# EasyEDA Pro project ProPrj_AIoT-NTU-Prototype_2026-03-28.epro, schematic Main Board

## Sheets
1 P1: Board Name: Main Board; Create Date: 2026-03-23; Page Name: P1; Project Name: AIoT-NTU-Prototype; Schematic Name: Main Board; Update Date: 2026-03-24; Company: EasyEDA.com; Page Size: A4; Version: V1.0
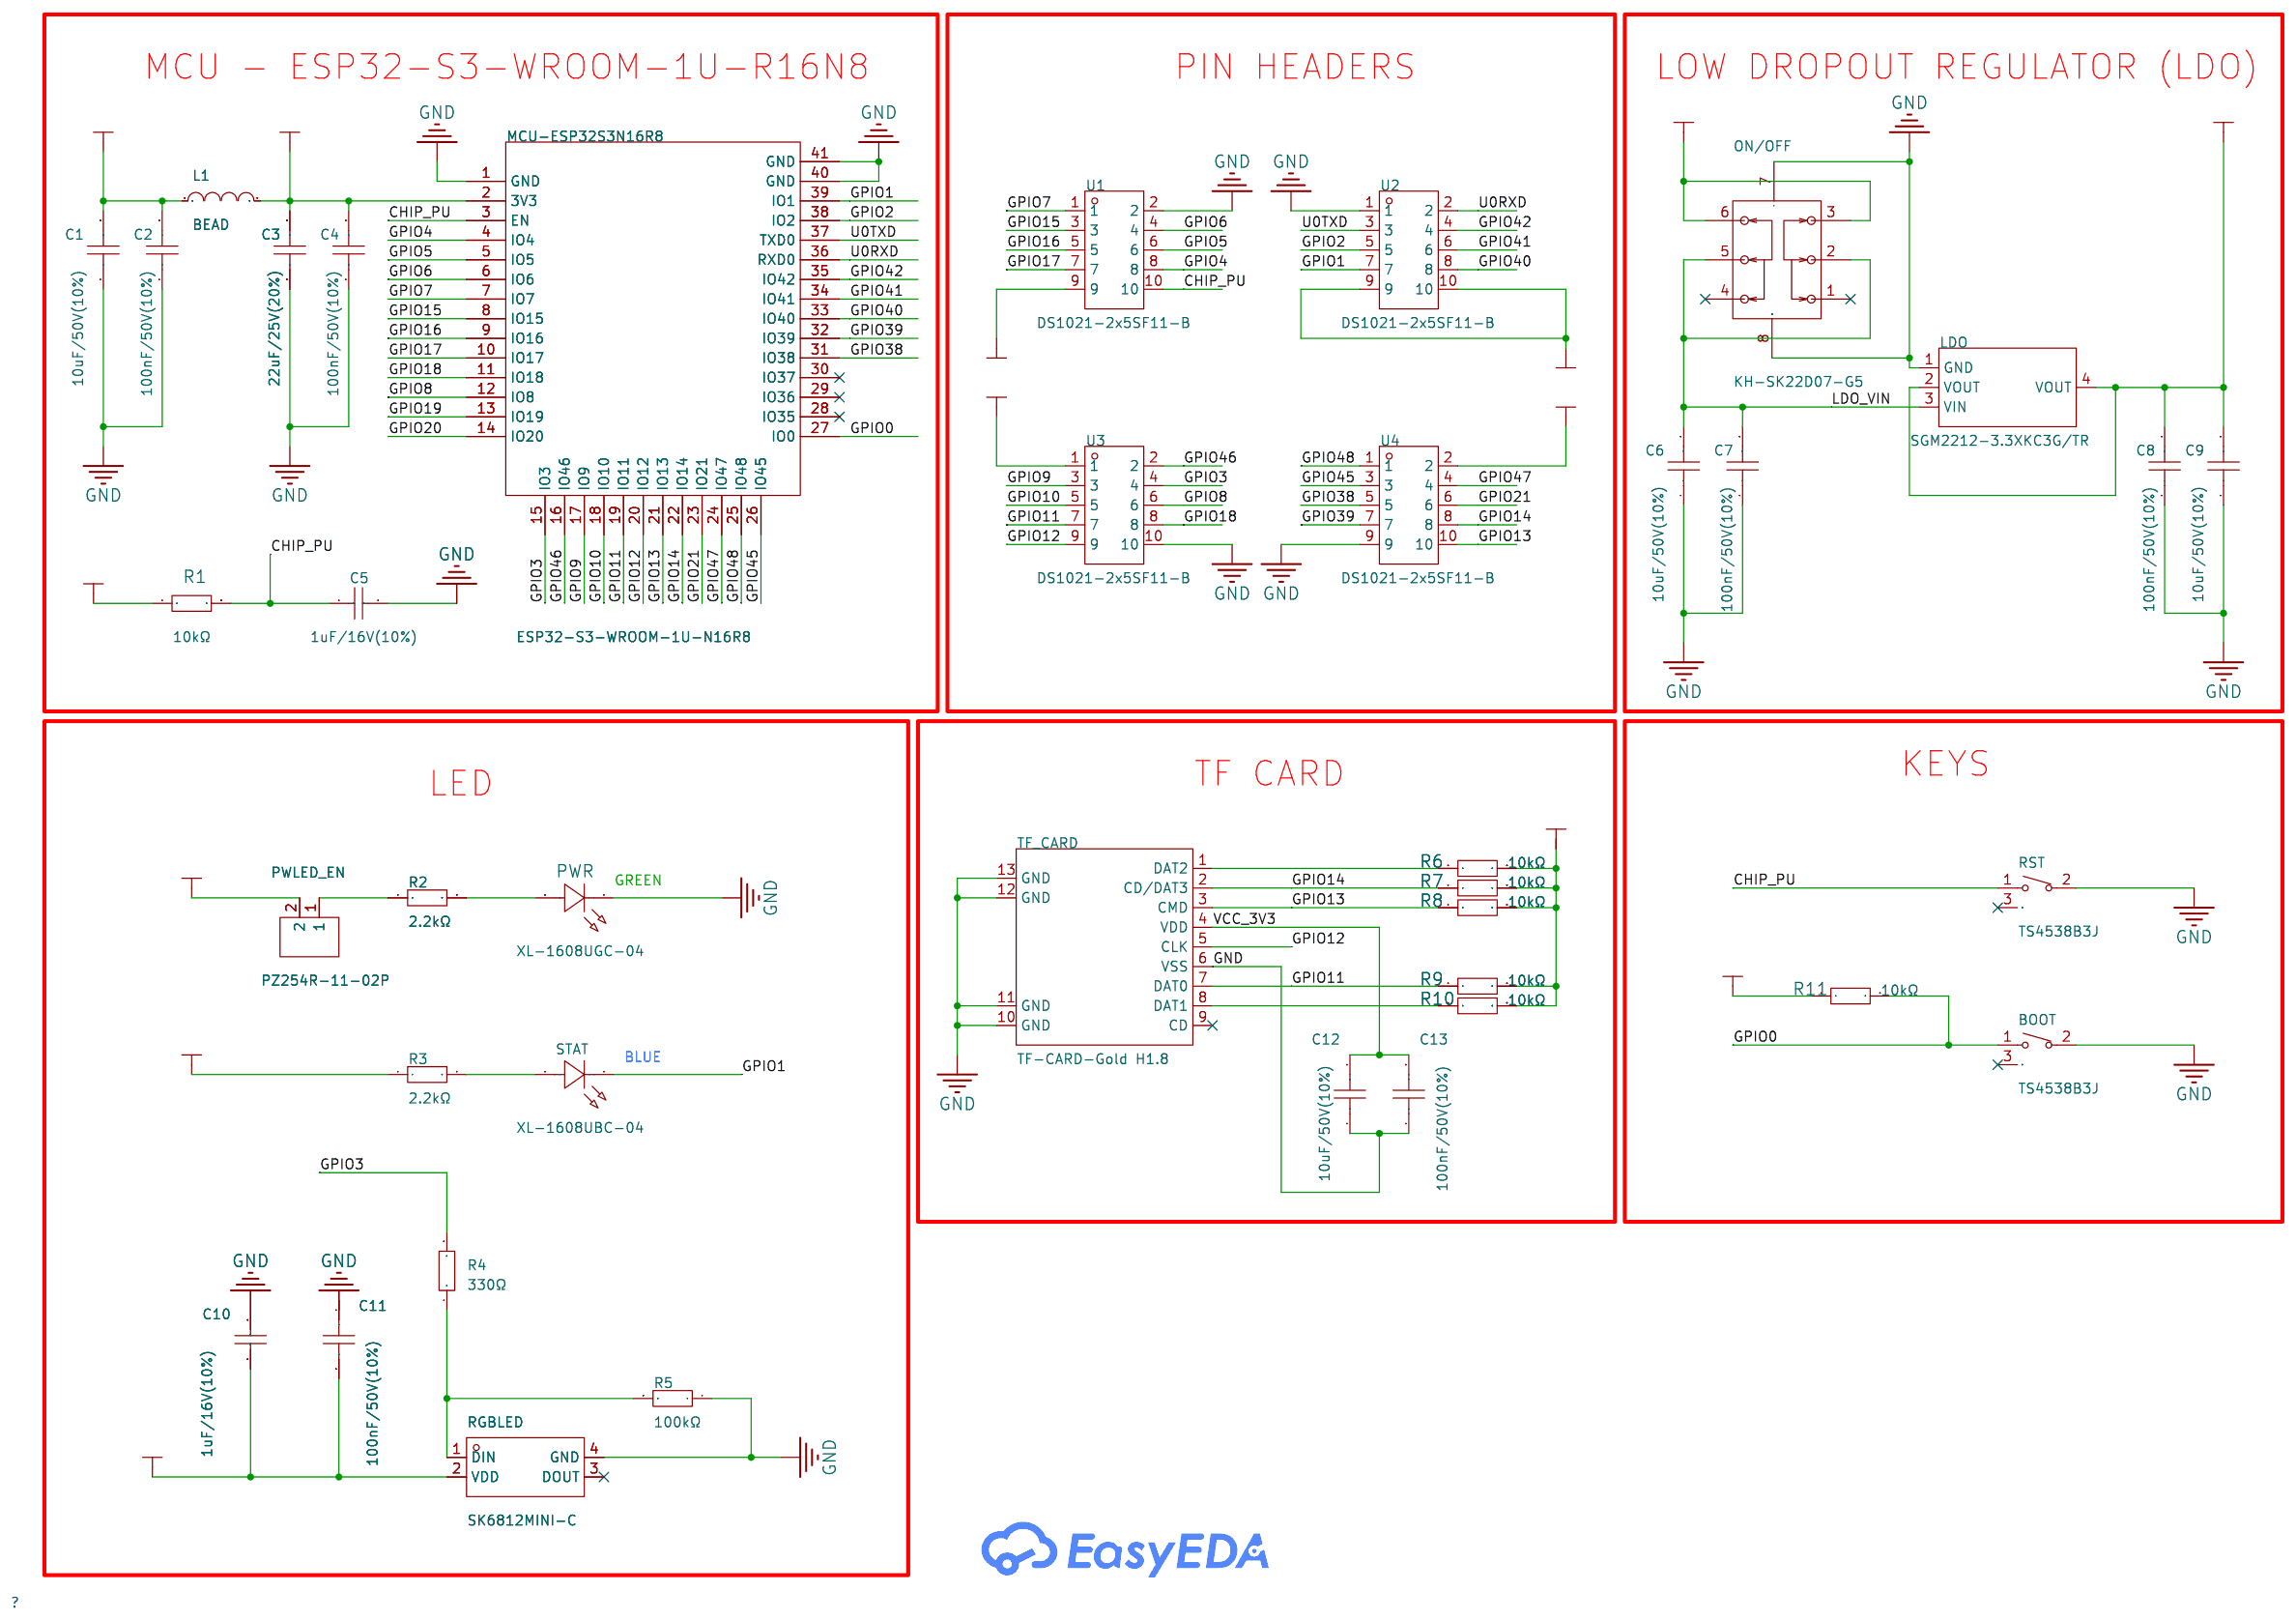
[diagram p1: P1]
2 P2: Page Name: P2; Update Date: 2026-03-27
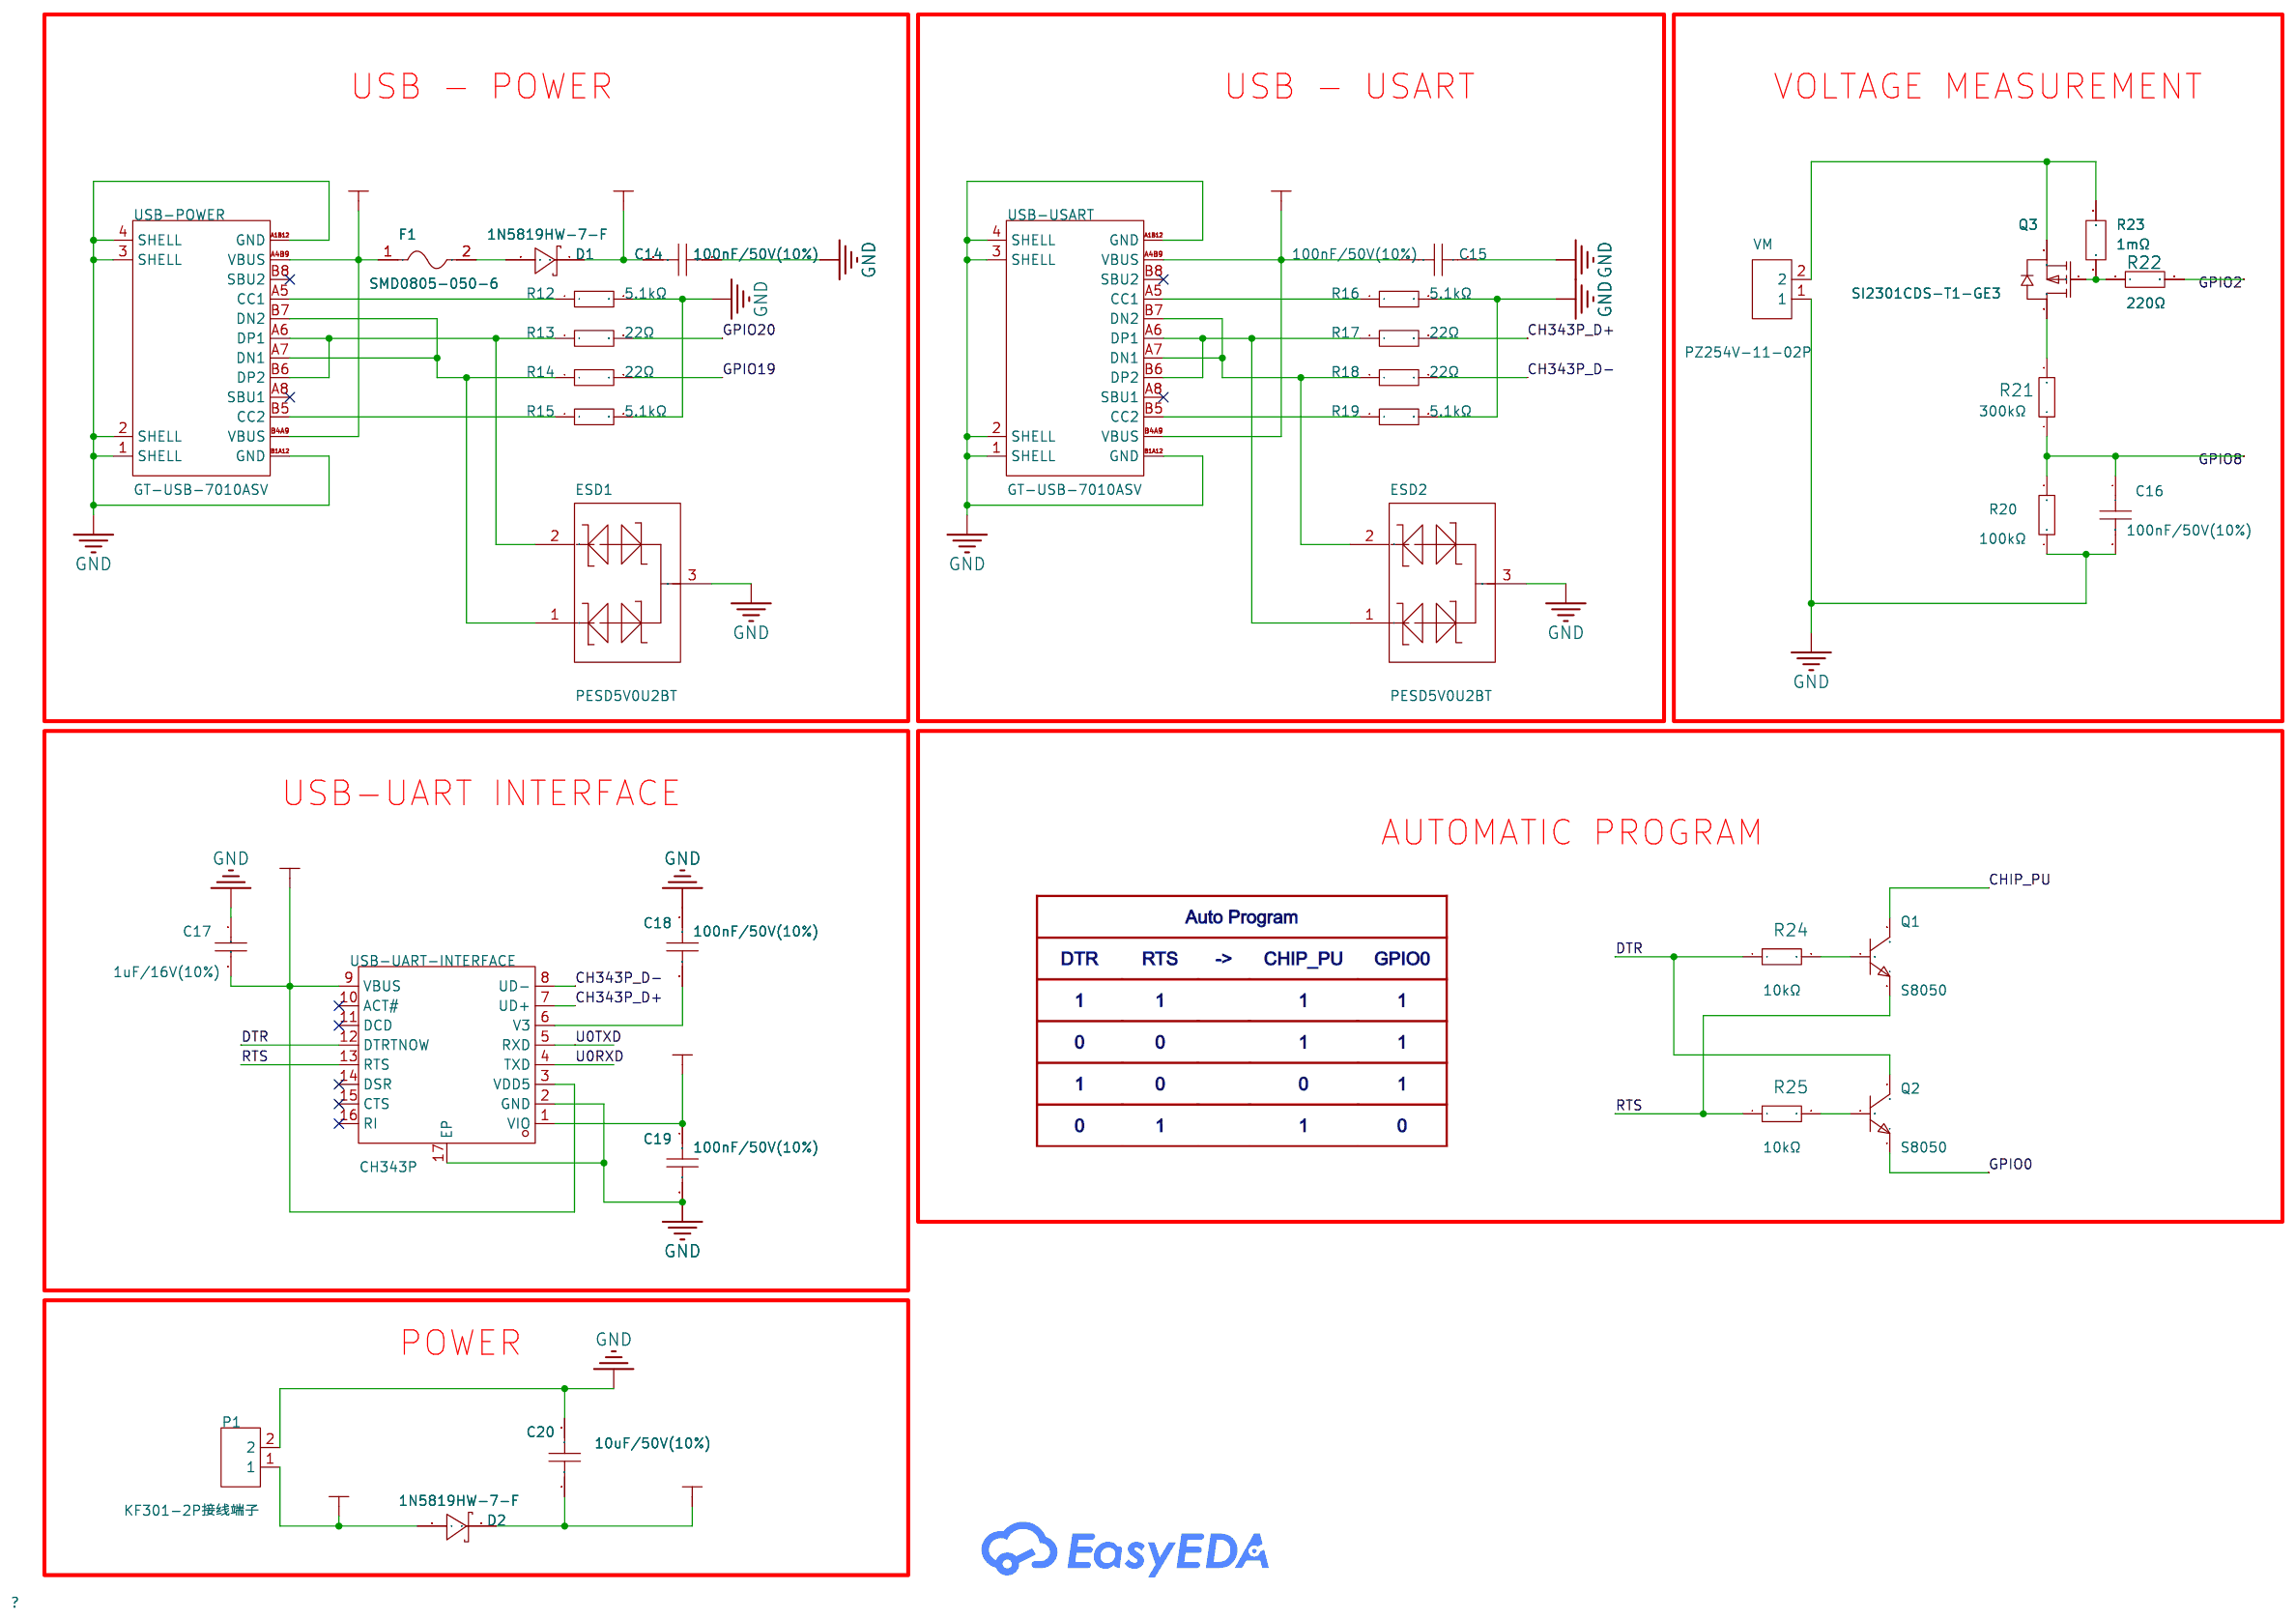
[diagram p2: P2]

## Parts
sheet P1
BOOT  TS4538B3J  [SW-TH_TS4538B3J]
C1  10uF/50V(10%)  [C0805]
C2  100nF/50V(10%)  [C0603]
C3  22uF/25V(20%)  [C0805]
C4  100nF/50V(10%)  [C0603]
C5  1uF/16V(10%)  [C0603]
C6  10uF/50V(10%)  [C0805]
C7  100nF/50V(10%)  [C0603]
C8  100nF/50V(10%)  [C0603]
C9  10uF/50V(10%)  [C0805]
C10  1uF/16V(10%)  [C0603]
C11  100nF/50V(10%)  [C0603]
C12  10uF/50V(10%)  [C0805]
C13  100nF/50V(10%)  [C0603]
L1  BEAD  [L0805]
LDO  SGM2212-3.3XKC3G/TR  [SOT-223-3_L6.5-W3.4-P2.30-LS7.0-BR]
MCU-ESP32S3N16R8  ESP32-S3-WROOM-1U-N16R8  [WIRELM-SMD_ESP32-S3-WROOM-1U]
ON/OFF  KH-SK22D07-G5  [SW-TH_KH-SK22D07-G5]
PWLED_EN  PZ254R-11-02P  [HDR-TH_2P-P2.54-H-M-W10.4]
PWR  XL-1608UGC-04  [LED0603-RD_GREEN]
R1  10kΩ  [R0603]
R2  2.2kΩ  [R0603]
R3  2.2kΩ  [R0603]
R4  330Ω  [R0603]
R5  100kΩ  [R0603]
R6  10kΩ  [R0603]
R7  10kΩ  [R0603]
R8  10kΩ  [R0603]
R9  10kΩ  [R0603]
R10  10kΩ  [R0603]
R11  10kΩ  [R0603]
RGBLED  SK6812MINI-C  [LED-SMD_4P-L3.5-W3.5-R-SK6812MINI]
RST  TS4538B3J  [SW-TH_TS4538B3J]
STAT  XL-1608UBC-04  [LED0603-RD_BLUE]
TF_CARD  TF-CARD-Gold H1.8  [TF-SMD_TF-CARD-H1.8]
U1  DS1021-2x5SF11-B  [HDR-TH_10P-P2.54-V-M-R2-C5-S2.54]
U2  DS1021-2x5SF11-B  [HDR-TH_10P-P2.54-V-M-R2-C5-S2.54]
U3  DS1021-2x5SF11-B  [HDR-TH_10P-P2.54-V-M-R2-C5-S2.54]
U4  DS1021-2x5SF11-B  [HDR-TH_10P-P2.54-V-M-R2-C5-S2.54]
sheet P2
C14  100nF/50V(10%)  [C0603]
C15  100nF/50V(10%)  [C0603]
C16  100nF/50V(10%)  [C0603]
C17  1uF/16V(10%)  [C0603]
C18  100nF/50V(10%)  [C0603]
C19  100nF/50V(10%)  [C0603]
C20  10uF/50V(10%)  [C0805]
D1  1N5819HW-7-F  [SOD-123_L2.7-W1.6-LS3.7-RD]
D2  1N5819HW-7-F  [SOD-123_L2.7-W1.6-LS3.7-RD]
ESD1  PESD5V0U2BT  [SOT-23-3_L2.9-W1.3-P1.90-LS2.4-BR]
ESD2  PESD5V0U2BT  [SOT-23-3_L2.9-W1.3-P1.90-LS2.4-BR]
F1  SMD0805-050-6  [F0805]
P1  KF301-2P接线端子  [CONN-TH_XY301V-A-5.0-2P]
Q1  S8050  [SOT-23-3_L2.9-W1.3-P1.90-LS2.4-BR]
Q2  S8050  [SOT-23-3_L2.9-W1.3-P1.90-LS2.4-BR]
Q3  SI2301CDS-T1-GE3  [SOT-23-3_L3.0-W1.7-P0.95-LS2.9-BR]
R12  5.1kΩ  [R0603]
R13  22Ω  [R0603]
R14  22Ω  [R0603]
R15  5.1kΩ  [R0603]
R16  5.1kΩ  [R0603]
R17  22Ω  [R0603]
R18  22Ω  [R0603]
R19  5.1kΩ  [R0603]
R20  100kΩ  [R0603]
R21  300kΩ  [R0603]
R22  220Ω  [R0603]
R23  1mΩ  [R0603]
R24  10kΩ  [R0603]
R25  10kΩ  [R0603]
USB-POWER  GT-USB-7010ASV  [USB-C-SMD_G-SWITCH_GT-USB-7010ASV]
USB-UART-INTERFACE  CH343P  [TQFN-16_L3.0-W3.0-P0.50-BL-EP1.7]
USB-USART  GT-USB-7010ASV  [USB-C-SMD_G-SWITCH_GT-USB-7010ASV]
VM  PZ254V-11-02P  [HDR-TH_2P-P2.54-V-M]

## Library data of the parts
BOOT RST = TS4538B3J: Circuit:SPST Actuator Style:Round Button Operating Force:250gf Mounting Style:Lying Switch Length:4.5mm Switch Width:4.5mm Switch Height:3.8mm Strike Gundam:不带 Contact Current:50mA Voltage Rating (DC):12V Insulation Resistance:100MΩ Actuator/Cap Color:Bla; LCSC Part Name: 4.5*4.5*3.8mm 卧插 轻触开关; Supplier Part: C2681490; Manufacturer: SHOU HAN(首韩); Supplier Footprint: 插件; JLCPCB Part Class: Extended Part; Datasheet: https://atta.szlcsc.com/upload/public/pdf/source/20210107/C2681490_30B9DCB4D025C2EF087670BE9B72D0BC.pdf; Supplier: LCSC; Circuit: SPST; Actuator Style: Round Button; Operating Force: 250gf; Mounting Style: Lying; Switch Length: 4.5mm; Switch Width: 4.5mm; Switch Height: 3.8mm; Strike Gundam: 不带; Contact Current: 50mA; Voltage Rating (DC): 12V; Insulation Resistance: 100MΩ; Actuator/Cap Color: Black; Pin Style: PCPin; Mechanical Life: 10万次; Operating Temperature: -25℃~+70℃
C1 C6 C9 C12 C20 = GRM21BR61H106KE43L: Capacitance:10uF Tolerance:±10% Tolerance:±10% Voltage Rating:50V Temperature Coefficient:X5R; LCSC Part Name: 10uF ±10% 50V; Supplier Part: C440198; Manufacturer: muRata(村田); Supplier Footprint: 0805; JLCPCB Part Class: Basic Part; Datasheet: https://item.szlcsc.com/datasheet/GRM21BR61H106KE43L/439567.html; Supplier: LCSC; Tolerance: ±10%; Voltage Rating: 50V; Temperature Coefficient: X5R
C2 C4 C7 C8 C11 C13-C16 C18 C19 = CC0603KRX7R9BB104: Capacitance:100nF Tolerance:±10% Tolerance:±10% Voltage Rating:50V Temperature Coefficient:X7R; LCSC Part Name: 100nF ±10% 50V; Supplier Part: C14663; Manufacturer: YAGEO(国巨); Supplier Footprint: 0603; JLCPCB Part Class: Basic Part; Datasheet: https://item.szlcsc.com/datasheet/CC0603KRX7R9BB104/15331.html; Supplier: LCSC; Tolerance: ±10%; Voltage Rating: 50V; Temperature Coefficient: X7R
C3 = CL21A226MAQNNNE: Capacitance:22uF Tolerance:±20% Tolerance:±20% Voltage Rating:25V Temperature Coefficient:X5R; LCSC Part Name: 22uF ±20% 25V; Supplier Part: C45783; Manufacturer: SAMSUNG(三星); Supplier Footprint: 0805; JLCPCB Part Class: Basic Part; Datasheet: https://item.szlcsc.com/datasheet/CL21A226MAQNNNE/46786.html; Supplier: LCSC; Tolerance: ±20%; Voltage Rating: 25V; Temperature Coefficient: X5R
C5 C10 C17 = CL10A105KO8NNNC: Capacitance:1uF Tolerance:±10% Tolerance:±10% Voltage Rating:16V Temperature Coefficient:X5R; LCSC Part Name: 1uF ±10% 16V; Supplier Part: C1592; Manufacturer: SAMSUNG(三星); Supplier Footprint: 0603; JLCPCB Part Class: Extended Part; Datasheet: https://item.szlcsc.com/datasheet/CL10A105KO8NNNC/1944.html; Supplier: LCSC; Tolerance: ±10%; Voltage Rating: 16V; Temperature Coefficient: X5R
L1 = 74279220601: Impedance @ Frequency:600Ω@100MHz Tolerance:±25% Tolerance:±25% DC Resistance(DCR):80mΩ Current Rating:2.1A Number of Circuits:1 Operating Temperature:-55℃~+125℃ Operating Temperature:-55℃~+125℃; LCSC Part Name: 单路 0805磁珠 阻抗600Ω@100MHz; Supplier Part: C2661425; Manufacturer: Wurth(伍尔特); Supplier Footprint: 0805; JLCPCB Part Class: Extended Part; Datasheet: https://www.we-online.com/components/products/datasheet/74279220601.pdf; Supplier: LCSC; Impedance @ Frequency: 600Ω@100MHz; Tolerance: ±25%; DC Resistance(DCR): 80mΩ; Current Rating: 2.1A; Number of Circuits: 1; Operating Temperature: -55℃~+125℃
LDO = SGM2212-3.3XKC3G/TR_C3294699: Output Type:Fixed Voltage - Supply:20V Output Voltage:3.3V Output Voltage:3.3V Output Current:800mA Power Supply Rejection Ratio (PSRR):80dB@(120Hz) Voltage Dropout:450mV@(800mA) standby current:80uA Noise:0.002%Vout Features:Short Circuit Protection；Ther; LCSC Part Name: 800mA、低噪声、低静态电流、高电源抑制比、低压差线性稳压器; Supplier Part: C3294699; Manufacturer: SGMICRO(圣邦微); Supplier Footprint: SOT-223-3; JLCPCB Part Class: Extended Part; Datasheet: https://item.szlcsc.com/datasheet/SGM2212-3.3XKC3G%252FTR/3859121.html; Supplier: LCSC; Output Type: Fixed; Voltage - Supply: 20V; Output Voltage: 3.3V; Output Current: 800mA; Power Supply Rejection Ratio (PSRR): 80dB@(120Hz); Voltage Dropout: 450mV@(800mA); standby current: 80uA; Noise: 0.002%Vout; Features: Short Circuit Protection；Thermal Shutdown; Operating Temperature: -40℃~+125℃
MCU-ESP32S3N16R8 = ESP32-S3-WROOM-1U-N16R8: Supplier Part: C3013946; Manufacturer: ESPRESSIF(乐鑫); Supplier Footprint: SMD,19.2x18mm; JLCPCB Part Class: Extended Part; Datasheet: https://item.szlcsc.com/datasheet/ESP32-S3-WROOM-1U-N16R8/3522416.html; Supplier: LCSC
ON/OFF = KH-SK22D07-G5: LCSC Part Name: 拨动开关 KH-SK22D07-G5 胶底(SK22D02); Supplier Part: C5274511; Manufacturer: kinghelm(金航标); Supplier Footprint: 插件; JLCPCB Part Class: Extended Part; Datasheet: https://atta.szlcsc.com/upload/public/pdf/source/20221118/893B1B9D65297A6DA5150F3A9CB4E986.pdf; Supplier: LCSC
PWLED_EN = PZ254R-11-02P: Pin Structure:1x2P Pitch:2.54mm Row Spacing:- Circluar Pins/Square Pins:Pin Header Mounting Type:Right Angle Number of Rows:1 Number of Pins:2P Current Rating:- Voltage Rating (Max):- Length of Mating Pin:6mm Insulation Height:2.5mm Contact Material:Brass; LCSC Part Name: 1x2P 间距:2.54mm 方针 弯插; Supplier Part: C492410; Manufacturer: XFCN(兴飞); Supplier Footprint: 弯插,P=2.54mm; JLCPCB Part Class: Extended Part; Datasheet: https://item.szlcsc.com/datasheet/PZ254R-11-02P/502966.html; Supplier: LCSC; Pin Structure: 1x2P; Pitch: 2.54mm; Circluar Pins/Square Pins: Pin Header; Mounting Type: Right Angle; Number of Rows: 1; Number of Pins: 2P; Length of Mating Pin: 6mm; Insulation Height: 2.5mm; Contact Material: Brass; Operating Temperature: -40℃~+105℃; Color: Black
PWR = XL-1608UGC-04: Lamp Holder Type:- Illumination Color:Emerald Green Voltage - Forward(Vf):3.3V Voltage - Forward(Vf):3.3V Power(Watts):70mW Forward Current:20mA Wavelength - Dominant:515nm~535nm Wavelength - Dominant:515nm~535nm Peak Wavelength:525nm Diode Configuration:; LCSC Part Name: 0603翠绿贴片式发光二极管; Supplier Part: C965804; Manufacturer: XINGLIGHT(成兴光); Supplier Footprint: 0603; JLCPCB Part Class: Extended Part; Datasheet: https://item.szlcsc.com/datasheet/XL-1608UGC-04/1051413.html; Supplier: LCSC; Illumination Color: Emerald Green; Voltage - Forward(Vf): 3.3V; Power(Watts): 70mW; Forward Current: 20mA; Wavelength - Dominant: 515nm~535nm; Peak Wavelength: 525nm; Diode Configuration: Discrete Diode; Lens Color: Water Clear; Luminous Intensity: 810mcd; Viewing Angle: 120°; Mounting Style: Top-mount; Operating Temperature: -40℃~+85℃
R1 R6-R11 R24 R25 = 0603WAF1002T5E: Type:Thick Film Resistor Resistance:10kΩ Tolerance:±1% Tolerance:±1% Power(Watts):100mW Voltage-Supply(Max):75V Temperature Coefficient:±100ppm/℃ Temperature Coefficient:±100ppm/℃ Operating Temperature:-55℃~+155℃ Operating Temperature:-55℃~+155℃; LCSC Part Name: 厚膜电阻 10kΩ ±1% 100mW; Supplier Part: C25804; Manufacturer: UNI-ROYAL(厚声); Supplier Footprint: 0603; JLCPCB Part Class: Basic Part; Datasheet: https://item.szlcsc.com/datasheet/0603WAF1002T5E/26547.html; Supplier: LCSC; Type: Thick Film Resistor; Tolerance: ±1%; Power(Watts): 100mW; Voltage-Supply(Max): 75V; Temperature Coefficient: ±100ppm/℃; Operating Temperature: -55℃~+155℃
R2 R3 = 0603WAF2201T5E_C4190: Type:Thick Film Resistors Resistance:2.2kΩ Tolerance:±1% Tolerance:±1% Power(Watts): Overload Voltage (Max): Temperature Coefficient:±100ppm/℃ Temperature Coefficient:±100ppm/℃ Operating Temperature Range:-55℃~+155℃ Operating Temperature Range:-55℃~+155℃; LCSC Part Name: 2.2kΩ ±1% 100mW 厚膜电阻; Supplier Part: C4190; Manufacturer: UNI-ROYAL(厚声); Manufacturer Part: 0603WAF2201T5E; Supplier Footprint: 0603; JLCPCB Part Class: Basic Part; Datasheet: https://atta.szlcsc.com/upload/public/pdf/source/20200306/C422600_1E6D84923E4A46A82E41ADD87F860B5C.pdf; Supplier: LCSC; Type: Thick Film Resistors; Tolerance: ±1%; Temperature Coefficient: ±100ppm/℃; Operating Temperature Range: -55℃~+155℃
R4 = 0603WAF3300T5E: Type:Thick Film Resistors Resistance: Tolerance:±1% Tolerance:±1% Power(Watts): Overload Voltage (Max): Temperature Coefficient:±100ppm/℃ Temperature Coefficient:±100ppm/℃ Operating Temperature Range:-55℃~+155℃ Operating Temperature Range:-55℃~+155℃; LCSC Part Name: 330Ω ±1% 100mW 厚膜电阻; Supplier Part: C23138; Manufacturer: UNI-ROYAL(厚声); Supplier Footprint: 0603; JLCPCB Part Class: Basic Part; Datasheet: https://atta.szlcsc.com/upload/public/pdf/source/20200306/C422600_1E6D84923E4A46A82E41ADD87F860B5C.pdf; Supplier: LCSC; Type: Thick Film Resistors; Tolerance: ±1%; Temperature Coefficient: ±100ppm/℃; Operating Temperature Range: -55℃~+155℃
R5 R20 = 0603WAF1003T5E: Type:Thick Film Resistor Resistance:100kΩ Tolerance:±1% Tolerance:±1% Power(Watts):100mW Voltage-Supply(Max):75V Temperature Coefficient:±100ppm/℃ Temperature Coefficient:±100ppm/℃ Operating Temperature:-55℃~+155℃ Operating Temperature:-55℃~+155℃; LCSC Part Name: 100kΩ ±1% 100mW 厚膜电阻; Supplier Part: C25803; Manufacturer: UNI-ROYAL(厚声); Supplier Footprint: 0603; JLCPCB Part Class: Basic Part; Datasheet: https://item.szlcsc.com/datasheet/0603WAF1003T5E/26546.html; Supplier: LCSC; Type: Thick Film Resistor; Tolerance: ±1%; Power(Watts): 100mW; Voltage-Supply(Max): 75V; Temperature Coefficient: ±100ppm/℃; Operating Temperature: -55℃~+155℃
RGBLED = SK6812MINI-C: Wavelength:R:615nm~625nm；B:460nm~470nm；G:520nm~530nm Luminous Intensity:B:160mcd~320mcd；R:280mcd~515mcd；G:815mcd~1275mcd Fixed-Frequency Pwm Mode:1kHz Voltage - Supply:3.7V~5.5V Voltage - Supply:3.7V~5.5V Quiescent Current:0.65mA ESD Withstand Voltage:200; Supplier Part: C7423117; Manufacturer: 欧思科光电; Supplier Footprint: SMD-4P,3.7x3.5mm; JLCPCB Part Class: Extended Part; Datasheet: https://item.szlcsc.com/datasheet/SK6812MINI-C/8407590.html; Supplier: LCSC; Wavelength: R:615nm~625nm；B:460nm~470nm；G:520nm~530nm; Luminous Intensity: B:160mcd~320mcd；R:280mcd~515mcd；G:815mcd~1275mcd; Fixed-Frequency Pwm Mode: 1kHz; Voltage - Supply: 3.7V~5.5V; Quiescent Current: 0.65mA; ESD Withstand Voltage: 2000V; Operating Temperature: -40℃~+85℃; Viewing Angle: 120°; Length: 3.5mm; Width: 1.1mm; Height: 3.7mm
STAT = XL-1608UBC-04: Lamp Holder Type:- Illumination Color:Blue Voltage - Forward(Vf):3.3V Voltage - Forward(Vf):3.3V Power(Watts):70mW Forward Current:20mA Wavelength - Dominant:455nm~475nm Wavelength - Dominant:455nm~475nm Peak Wavelength:470nm Diode Configuration:- Lens Co; LCSC Part Name: 0603蓝色贴片式发光二极管; Supplier Part: C965807; Manufacturer: XINGLIGHT(成兴光); Supplier Footprint: 0603; JLCPCB Part Class: Extended Part; Datasheet: https://item.szlcsc.com/datasheet/XL-1608UBC-04/1051416.html; Supplier: LCSC; Illumination Color: Blue; Voltage - Forward(Vf): 3.3V; Power(Watts): 70mW; Forward Current: 20mA; Wavelength - Dominant: 455nm~475nm; Peak Wavelength: 470nm; Lens Color: Water Clear; Luminous Intensity: 300mcd; Viewing Angle: 120°; Mounting Style: op View Mount
TF_CARD = TF-CARD-Gold H1.8: Card Connection Mode:Push-Push Card Type:MicroSD Card (TF Card) Connector Type:Connector and Ejector Additional Card Detection Pins:- Supplementary Features:- Height Above Board:1.8mm Operating Temperature:-40℃~+70℃ Operating Temperature:-40℃~+70℃; LCSC Part Name: 9P，自弹式TF卡座; Supplier Part: C7529390; Manufacturer: SHOU HAN(首韩); Supplier Footprint: SMD; JLCPCB Part Class: Extended Part; Datasheet: https://item.szlcsc.com/datasheet/TF-CARD-Gold%2520H1.8/8629777.html; Supplier: LCSC; Card Connection Mode: Push-Push; Card Type: MicroSD Card (TF Card); Connector Type: Connector and Ejector; Height Above Board: 1.8mm; Operating Temperature: -40℃~+70℃
U1-U4 = DS1021-2x5SF11-B: Pin Structure:2x5P Pitch:2.54mm Row Spacing:2.54mm Circluar Pins/Square Pins:Pin Header Mounting Type:Through Hole Number of Rows:2 Number of Pins:10P Current Rating:3A Voltage Rating (Max):250V Contact Material:Copper Alloy Contact Plating:Gold Operating; LCSC Part Name: 2x5P 间距:2.54mm 方针 直插; Supplier Part: C7430401; Manufacturer: CONNFLY; Supplier Footprint: 插件,P=2.54mm; Datasheet: https://item.szlcsc.com/datasheet/DS1021-2x5SF11-B/8430054.html; Supplier: LCSC; Pin Structure: 2x5P; Pitch: 2.54mm; Row Spacing: 2.54mm; Circluar Pins/Square Pins: Pin Header; Mounting Type: Through Hole; Number of Rows: 2; Number of Pins: 10P; Current Rating: 3A; Voltage Rating (Max): 250V; Contact Material: Copper Alloy; Contact Plating: Gold; Operating Temperature: -40℃~+105℃; Color: Black
D1 D2 = 1N5819HW-7-F: Diode Configuration:1 Independent Voltage - Forward(Vf@If):450mV@1A Voltage - DC Reverse(Vr):40V Current - Rectified:1A Reverse Leakage Current (Ir):1mA@40V Operating Junction Temperature Range:-65℃~+150℃ Operating Junction Temperature Range:-65℃~+150℃ No; LCSC Part Name: 电压:40V 电流:1A; Supplier Part: C82544; Manufacturer: DIODES(美台); Supplier Footprint: SOD-123; JLCPCB Part Class: Extended Part; Datasheet: https://item.szlcsc.com/datasheet/1N5819HW-7-F/83701.html; Supplier: LCSC; Diode Configuration: 1 Independent; Voltage - Forward(Vf@If): 450mV@1A; Voltage - DC Reverse(Vr): 40V; Current - Rectified: 1A; Reverse Leakage Current (Ir): 1mA@40V; Operating Junction Temperature Range: -65℃~+150℃; Non-Repetitive Peak Forward Surge Current: 25A
ESD1 ESD2 = PESD5V0U2BT: Polarity:Bidirectional Reverse Stand-Off Voltage (Vrwm):5V Voltage - Breakdown:9V Reverse Leakage Current (Ir):60nA Number of Channels:2 level of protection:IEC 61000-4-5 Type:ESD Junction Capacitance:2.5pF; LCSC Part Name: ESD 5V截止; Supplier Part: C2905622; Manufacturer: TECH PUBLIC(台舟); Supplier Footprint: SOT-23; JLCPCB Part Class: Extended Part; Datasheet: https://item.szlcsc.com/datasheet/PESD5V0U2BT/3175919.html; Supplier: LCSC; Polarity: Bidirectional; Reverse Stand-Off Voltage (Vrwm): 5V; Voltage - Breakdown: 9V; Reverse Leakage Current (Ir): 60nA; Number of Channels: 2; level of protection: IEC 61000-4-5; Type: ESD; Junction Capacitance: 2.5pF
F1 = SMD0805-050-6: Voltage - Max:6V Current - Max:40A Hold Current:500mA Trip Current:1A Power Dissipation:500mW Resistance - Initial (Ri) (Min):100mΩ Resistance - Post Trip (R1) (Max):850mΩ Time to Trip(Max):100ms Operating Temperature:-40℃~+85℃ Operating Temperature:-40℃~; LCSC Part Name: 6V 500mA; Supplier Part: C46640983; Manufacturer: R+O(宏嘉诚); Supplier Footprint: 0805; JLCPCB Part Class: Extended Part; Datasheet: https://item.szlcsc.com/datasheet/SMD0805-050-6/48798689.html; Supplier: LCSC; Voltage - Max: 6V; Current - Max: 40A; Hold Current: 500mA; Trip Current: 1A; Power Dissipation: 500mW; Resistance - Initial (Ri) (Min): 100mΩ; Resistance - Post Trip (R1) (Max): 850mΩ; Time to Trip(Max): 100ms; Operating Temperature: -40℃~+85℃; Length: 2.2mm; Width: 1.5mm; Height: 0.8mm
P1 = KF301-2P接线端子: Supplier Part: C9900016950; Supplier Footprint: CK301-2P; JLCPCB Part Class: Extended Part; Supplier: LCSC
Q1 Q2 = S8050_C2688231: type:NPN Current - Collector(Ic):800mA Collector - Emitter Voltage VCEO:25V Pd - Power Dissipation:350mW DC Current Gain:200@50mA,1V DC Current Gain:200@50mA,1V Transition frequency(fT):150MHz Current - Collector Cutoff:100nA Vce Saturation(VCE(sat)):600m; LCSC Part Name: NPN 电流:0.8A 电压:25V; Supplier Part: C2688231; Manufacturer: WPMtek(维攀); Supplier Footprint: SOT-23; JLCPCB Part Class: Extended Part; Datasheet: https://item.szlcsc.com/datasheet/S8050/2793369.html; Supplier: LCSC; type: NPN; Current - Collector(Ic): 800mA; Collector - Emitter Voltage VCEO: 25V; Pd - Power Dissipation: 350mW; DC Current Gain: 200@50mA,1V; Transition frequency(fT): 150MHz; Current - Collector Cutoff: 100nA; Vce Saturation(VCE(sat)): 600mV@500mA,50mA; Emitter-Base Voltage(Vebo): 5V
Q3 = SI2301CDS-T1-GE3: Number:1 P-Channel Drain to Source Voltage:20V Current - Continuous Drain(Id):3.1A RDS(on):142mΩ@2.5V,2.7A Pd - Power Dissipation:1.6W Gate Threshold Voltage (Vgs(th)):1V@250uA Gate Charge(Qg):10nC@4.5V Input Capacitance(Ciss):405pF Reverse Transfer Capac; LCSC Part Name: 1个P沟道 耐压:20V 电流:3.1A; Supplier Part: C10487; Manufacturer: VISHAY(威世); Supplier Footprint: SOT-23; Datasheet: https://item.szlcsc.com/datasheet/SI2301CDS-T1-GE3/11030.html; Supplier: LCSC; Number: 1 P-Channel; Drain to Source Voltage: 20V; Current - Continuous Drain(Id): 3.1A; RDS(on): 142mΩ@2.5V,2.7A; Pd - Power Dissipation: 1.6W; Gate Threshold Voltage (Vgs(th)): 1V@250uA; Gate Charge(Qg): 10nC@4.5V; Input Capacitance(Ciss): 405pF; Reverse Transfer Capacitance (Crss@Vds): 55pF; Operating Temperature: -55℃~+150℃; Type: P-Channel; Output Capacitance(Coss): 75pF
R12 R15 R16 R19 = 0603WAF5101T5E: Type:Thick Film Resistor Resistance:5.1kΩ Tolerance:±1% Tolerance:±1% Power(Watts):100mW Voltage-Supply(Max):75V Temperature Coefficient:±100ppm/℃ Temperature Coefficient:±100ppm/℃ Operating Temperature:-55℃~+155℃ Operating Temperature:-55℃~+155℃; LCSC Part Name: 5.1kΩ ±1% 100mW 厚膜电阻; Supplier Part: C23186; Manufacturer: UNI-ROYAL(厚声); Supplier Footprint: 0603; JLCPCB Part Class: Basic Part; Datasheet: https://item.szlcsc.com/datasheet/0603WAF5101T5E/23913.html; Supplier: LCSC; Type: Thick Film Resistor; Tolerance: ±1%; Power(Watts): 100mW; Voltage-Supply(Max): 75V; Temperature Coefficient: ±100ppm/℃; Operating Temperature: -55℃~+155℃
R13 R14 R17 R18 = 0603WAF220JT5E: Type:Thick Film Resistors Resistance:22Ω Tolerance:±1% Tolerance:±1% Power(Watts): Overload Voltage (Max): Temperature Coefficient:±100ppm/℃ Temperature Coefficient:±100ppm/℃ Operating Temperature Range:-55℃~+155℃ Operating Temperature Range:-55℃~+155℃; LCSC Part Name: 22Ω ±1% 100mW 厚膜电阻; Supplier Part: C23345; Manufacturer: UNI-ROYAL(厚声); Supplier Footprint: 0603; JLCPCB Part Class: Basic Part; Datasheet: https://atta.szlcsc.com/upload/public/pdf/source/20200306/C422600_1E6D84923E4A46A82E41ADD87F860B5C.pdf; Supplier: LCSC; Type: Thick Film Resistors; Tolerance: ±1%; Temperature Coefficient: ±100ppm/℃; Operating Temperature Range: -55℃~+155℃
R21 = 0603WAF3003T5E: Type:Thick Film Resistor Resistance:300kΩ Tolerance:±1% Tolerance:±1% Power(Watts):100mW Voltage-Supply(Max):75V Temperature Coefficient:±100ppm/℃ Temperature Coefficient:±100ppm/℃ Operating Temperature:-55℃~+155℃ Operating Temperature:-55℃~+155℃; LCSC Part Name: 300kΩ ±1% 100mW 厚膜电阻; Supplier Part: C23024; Manufacturer: UNI-ROYAL(厚声); Supplier Footprint: 0603; Datasheet: https://item.szlcsc.com/datasheet/0603WAF3003T5E/23751.html; Supplier: LCSC; Type: Thick Film Resistor; Tolerance: ±1%; Power(Watts): 100mW; Voltage-Supply(Max): 75V; Temperature Coefficient: ±100ppm/℃; Operating Temperature: -55℃~+155℃
R22 = 0603WAF2200T5E: Type:Thick Film Resistors Resistance: Tolerance:±1% Tolerance:±1% Power(Watts): Overload Voltage (Max): Temperature Coefficient:±100ppm/℃ Temperature Coefficient:±100ppm/℃ Operating Temperature Range:-55℃~+155℃ Operating Temperature Range:-55℃~+155℃; LCSC Part Name: 220Ω ±1% 100mW 厚膜电阻; Supplier Part: C22962; Manufacturer: UNI-ROYAL(厚声); Supplier Footprint: 0603; JLCPCB Part Class: Basic Part; Datasheet: https://atta.szlcsc.com/upload/public/pdf/source/20200306/C422600_1E6D84923E4A46A82E41ADD87F860B5C.pdf; Supplier: LCSC; Type: Thick Film Resistors; Tolerance: ±1%; Temperature Coefficient: ±100ppm/℃; Operating Temperature Range: -55℃~+155℃
R23 = PA0603FRP070R001L: Type:- Resistance:1mΩ Tolerance:±1% Tolerance:±1% Power(Watts):100mW Temperature Coefficient:±300ppm/℃ Temperature Coefficient:±300ppm/℃ Operating Temperature:-55℃~+155℃ Operating Temperature:-55℃~+155℃; LCSC Part Name: 1mΩ ±1% 100mW; Supplier Part: C6949223; Manufacturer: YAGEO(国巨); Supplier Footprint: 0603; Datasheet: https://item.szlcsc.com/datasheet/PA0603FRP070R001L/7915052.html; Supplier: LCSC; Tolerance: ±1%; Power(Watts): 100mW; Temperature Coefficient: ±300ppm/℃; Operating Temperature: -55℃~+155℃
USB-POWER USB-USART = GT-USB-7010ASV: Connector Type:Type-C Standard:USB 2.0 Gender:Female Mounting Style:Horizontal attachment Number of Contacts:16P Number of Ports:1 Current Rating - Power (Max):3A Rated Voltage (Max):24V Connect-Disconnect Life:10,000 times Center Height:1.68mm Length:7.3; LCSC Part Name: Type-C 母 卧贴; Supplier Part: C2988369; Manufacturer: G-Switch(品赞); Supplier Footprint: SMD; JLCPCB Part Class: Extended Part; Datasheet: https://atta.szlcsc.com/upload/public/pdf/source/20230327/DF227B64686AC8FA0AD1775797F2C3F1.pdf; Supplier: LCSC; Connector Type: Type-C; Standard: USB 2.0; Gender: Female; Mounting Style: Horizontal attachment; Number of Contacts: 16P; Number of Ports: 1; Current Rating - Power (Max): 3A; Rated Voltage (Max): 24V; Connect-Disconnect Life: 10,000 times; Center Height: 1.68mm; Length: 7.35mm; Core Colour: Black; Operating Temperature Range: -40℃~+85℃
USB-UART-INTERFACE = CH343P: Applications Function:USB to UART USB Protocol:USB 2.0 Number of Channels:- Voltage - Supply:3.3V；5V Voltage - Supply:3.3V；5V Data Rate:6Mbps Operating Temperature:-40℃~+85℃ Operating Temperature:-40℃~+85℃ Current - Supply:3mA Supply Current (Iq):90uA; Supplier Part: C2846043; Manufacturer: WCH(南京沁恒); Supplier Footprint: TQFN-16-EP(3x3); JLCPCB Part Class: Extended Part; Datasheet: https://item.szlcsc.com/datasheet/CH343P/3039795.html; Supplier: LCSC; Applications Function: USB to UART; USB Protocol: USB 2.0; Voltage - Supply: 3.3V；5V; Data Rate: 6Mbps; Operating Temperature: -40℃~+85℃; Current - Supply: 3mA; Supply Current (Iq): 90uA
VM = PZ254V-11-02P: Pin Structure:1x2P Pitch:2.54mm Row Spacing:- Circluar Pins/Square Pins:Pin Header Mounting Type:Through Hole Number of Rows:1 Number of Pins:2P Current Rating:3A Voltage Rating (Max):250V Length of Mating Pin:6mm Insulation Height:2.5mm Length of End Con; LCSC Part Name: 1x2P 间距:2.54mm 方针 直插; Supplier Part: C492401; Manufacturer: XFCN(兴飞); Supplier Footprint: 插件,P=2.54mm; Datasheet: https://item.szlcsc.com/datasheet/PZ254V-11-02P/502957.html; Supplier: LCSC; Pin Structure: 1x2P; Pitch: 2.54mm; Circluar Pins/Square Pins: Pin Header; Mounting Type: Through Hole; Number of Rows: 1; Number of Pins: 2P; Current Rating: 3A; Voltage Rating (Max): 250V; Length of Mating Pin: 6mm; Insulation Height: 2.5mm; Length of End Connection Pin: 3mm; Contact Material: Brass; Operating Temperature: -40℃~+105℃; Color: Black

## Nets
GND: BOOT.2 C1.1 C2.1 C3.1 C4.1 C5.2 C6.1 C7.1 C8.1 C9.1 C10.2 C11.1 C12.1 C13.1 C14.1 C15.1 C16.2 C17.2 C18.1 C19.2 C20.2 ESD1.3 ESD2.3 LDO.1(GND) MCU-ESP32S3N16R8.1(GND) MCU-ESP32S3N16R8.40(GND) MCU-ESP32S3N16R8.41(GND) ON/OFF.7 ON/OFF.8 P1.2 PWR.1(K) R5.1 R12.2 R15.2 R16.2 R19.2 R20.1 RGBLED.4(GND) RST.2 TF_CARD.6(VSS) TF_CARD.10(GND) TF_CARD.11(GND) TF_CARD.12(GND) TF_CARD.13(GND) U1.2 U2.1 U3.10 U4.9 USB-POWER.1(SHELL) USB-POWER.2(SHELL) USB-POWER.3(SHELL) USB-POWER.4(SHELL) USB-POWER.A1B12(GND) USB-POWER.B1A12(GND) USB-UART-INTERFACE.2(GND) USB-UART-INTERFACE.17(EP) USB-USART.1(SHELL) USB-USART.2(SHELL) USB-USART.3(SHELL) USB-USART.4(SHELL) USB-USART.A1B12(GND) USB-USART.B1A12(GND) VM.1
VCC_3V3: C1.2 C2.2 C8.2 C9.2 C12.2 C13.2 L1.1 LDO.2(VOUT) LDO.4(VOUT) PWLED_EN.2 R6.2 R7.2 R8.2 R9.2 R10.2 TF_CARD.4(VDD)
VCC_5V: C14.2 C20.1 D1.1(K) D2.1(K) ON/OFF.3 ON/OFF.6
VINPUT: C15.2 C17.1 D2.2(A) F1.1 P1.1 USB-POWER.A4B9(VBUS) USB-POWER.B4A9(VBUS) USB-UART-INTERFACE.3(VDD5) USB-UART-INTERFACE.9(VBUS) USB-USART.A4B9(VBUS) USB-USART.B4A9(VBUS)
CH343P_D+: R17.2 USB-UART-INTERFACE.7(UD+)
CH343P_D-: R18.2 USB-UART-INTERFACE.8(UD-)
CHIP_PU: C5.1 MCU-ESP32S3N16R8.3(EN) Q1.3(C) R1.2 RST.1 U1.10
DTR: Q2.3(C) R24.1 USB-UART-INTERFACE.12(DTRTNOW)
ESP_3V3: C3.2 C4.2 C10.1 C11.2 C19.1 L1.2 MCU-ESP32S3N16R8.2(3V3) R1.1 R3.1 R11.1 RGBLED.2(VDD) U1.9 U2.9 U2.10 U3.1 U4.2 USB-UART-INTERFACE.1(VIO)
GPIO0: BOOT.1 MCU-ESP32S3N16R8.27(IO0) Q2.2(E) R11.2
GPIO1: MCU-ESP32S3N16R8.39(IO1) STAT.1(K) U2.7
GPIO2: MCU-ESP32S3N16R8.38(IO2) R22.2 U2.5
GPIO3: MCU-ESP32S3N16R8.15(IO3) R4.2 U3.4
GPIO4: MCU-ESP32S3N16R8.4(IO4) U1.8
GPIO5: MCU-ESP32S3N16R8.5(IO5) U1.6
GPIO6: MCU-ESP32S3N16R8.6(IO6) U1.4
GPIO7: MCU-ESP32S3N16R8.7(IO7) U1.1
GPIO8: C16.1 MCU-ESP32S3N16R8.12(IO8) R20.2 R21.1 U3.6
GPIO9: MCU-ESP32S3N16R8.17(IO9) U3.3
GPIO10: MCU-ESP32S3N16R8.18(IO10) U3.5
GPIO11: MCU-ESP32S3N16R8.19(IO11) R9.1 TF_CARD.7(DAT0) U3.7
GPIO12: MCU-ESP32S3N16R8.20(IO12) TF_CARD.5(CLK) U3.9
GPIO13: MCU-ESP32S3N16R8.21(IO13) R8.1 TF_CARD.3(CMD) U4.10
GPIO14: MCU-ESP32S3N16R8.22(IO14) R7.1 TF_CARD.2(CD/DAT3) U4.8
GPIO15: MCU-ESP32S3N16R8.8(IO15) U1.3
GPIO16: MCU-ESP32S3N16R8.9(IO16) U1.5
GPIO17: MCU-ESP32S3N16R8.10(IO17) U1.7
GPIO18: MCU-ESP32S3N16R8.11(IO18) U3.8
GPIO19: MCU-ESP32S3N16R8.13(IO19) R14.2
GPIO20: MCU-ESP32S3N16R8.14(IO20) R13.2
GPIO21: MCU-ESP32S3N16R8.23(IO21) U4.6
GPIO38: MCU-ESP32S3N16R8.31(IO38) U4.5
GPIO39: MCU-ESP32S3N16R8.32(IO39) U4.7
GPIO40: MCU-ESP32S3N16R8.33(IO40) U2.8
GPIO41: MCU-ESP32S3N16R8.34(IO41) U2.6
GPIO42: MCU-ESP32S3N16R8.35(IO42) U2.4
GPIO45: MCU-ESP32S3N16R8.26(IO45) U4.3
GPIO46: MCU-ESP32S3N16R8.16(IO46) U3.2
GPIO47: MCU-ESP32S3N16R8.24(IO47) U4.4
GPIO48: MCU-ESP32S3N16R8.25(IO48) U4.1
LDO_VIN: C6.2 C7.2 LDO.3(VIN) ON/OFF.2 ON/OFF.5
RTS: Q1.2(E) R25.1 USB-UART-INTERFACE.13(RTS)
U0RXD: MCU-ESP32S3N16R8.36(RXD0) U2.2 USB-UART-INTERFACE.4(TXD)
U0TXD: MCU-ESP32S3N16R8.37(TXD0) U2.3 USB-UART-INTERFACE.5(RXD)
$1N1197: PWLED_EN.1 R2.1
$1N1198: PWR.2(A) R2.2
$1N1201: R3.2 STAT.2(A)
$1N1448: R4.1 R5.2 RGBLED.1(DIN)
$1N1818: R6.1 TF_CARD.1(DAT2)
$1N1819: R10.1 TF_CARD.8(DAT1)
$2N527: R12.1 USB-POWER.A5(CC1)
$2N528: R15.1 USB-POWER.B5(CC2)
$2N529: ESD1.2 R13.1 USB-POWER.A6(DP1) USB-POWER.B6(DP2)
$2N532: ESD1.1 R14.1 USB-POWER.A7(DN1) USB-POWER.B7(DN2)
$2N538: D1.2(A) F1.2
$2N916: R16.1 USB-USART.A5(CC1)
$2N917: R19.1 USB-USART.B5(CC2)
$2N923: ESD2.1 R17.1 USB-USART.A6(DP1) USB-USART.B6(DP2)
$2N927: ESD2.2 R18.1 USB-USART.A7(DN1) USB-USART.B7(DN2)
$2N1387: C18.2 USB-UART-INTERFACE.6(V3)
$2N1709: Q1.1(B) R24.2
$2N1712: Q2.1(B) R25.2
$2N7675: Q3.2(S) R23.2 VM.2
$2N7739: Q3.1(G) R22.1 R23.1
$2N7794: Q3.3(D) R21.2

Not connected (* = marked no-connect by the designer): BOOT 3*; MCU-ESP32S3N16R8 28(IO35)* 29(IO36)* 30(IO37)*; ON/OFF 1* 4*; RGBLED 3(DOUT)*; RST 3*; TF_CARD 9(CD)*; USB-POWER A8(SBU1)* B8(SBU2)*; USB-UART-INTERFACE 10(ACT#)* 11(DCD)* 14(DSR)* 15(CTS)* 16(RI)*; USB-USART A8(SBU1)* B8(SBU2)*

## Notes on the sheets
sheet 1
- MCU - ESP32-S3-WROOM-1U-R16N8
- PIN HEADERS
- LOW DROPOUT REGULATOR (LDO)
- TF CARD
- KEYS
- LED
- GREEN
- BLUE
sheet 2
- USB - POWER
- USB - USART
- VOLTAGE MEASUREMENT
- USB-UART INTERFACE
- AUTOMATIC PROGRAM
- POWER
